# EAGLE design Sapflux-Basic_AltA (EAGLE 9.6.2)
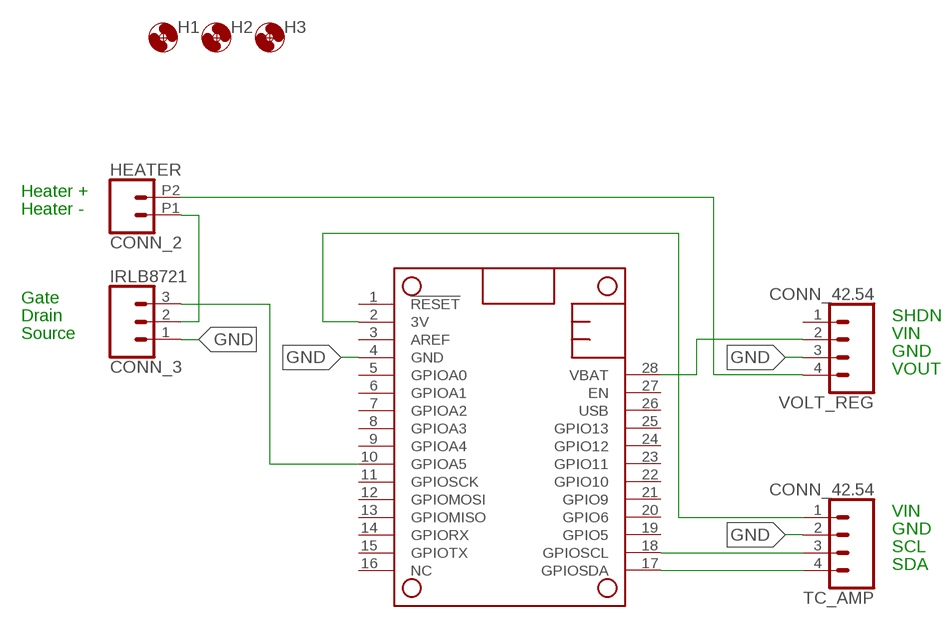
[diagram p0: schematic, sheet 1]

## Parts
H1  MOUNTING_HOLE4_NP  [4_40]
H2  MOUNTING_HOLE4_NP  [4_40]
H3  MOUNTING_HOLE4_NP  [4_40]
HEATER  CONN_2  CONN_022.54_SCREW_ROUND  [1X02_2.54_SCREWTERM_ROUND]
IRLB8721  CONN_3  [1X03]
MS1  FEATHERWINGLAYOUT  [FEATHERWING_MIN]
TC_AMP  CONN_42.54  [1X04]
VOLT_REG  CONN_42.54  [1X04]

## Nets
3V: MS1.2(3V) TC_AMP.1
GND: IRLB8721.1 MS1.4(GND) TC_AMP.2 VOLT_REG.3
N$1: MS1.17(GPIOSDA) TC_AMP.4
N$2: MS1.18(GPIOSCL) TC_AMP.3
N$3: HEATER.P2 VOLT_REG.4
N$4: HEATER.P1 IRLB8721.2
N$5: IRLB8721.3 MS1.10(GPIOA5)
VBAT: MS1.28(VBAT) VOLT_REG.2
Unconnected: MS1.1(!RESET) MS1.3(AREF) MS1.5(GPIOA0) MS1.6(GPIOA1) MS1.7(GPIOA2) MS1.8(GPIOA3) MS1.9(GPIOA4) MS1.11(GPIOSCK) MS1.12(GPIOMOSI) MS1.13(GPIOMISO) MS1.14(GPIORX) MS1.15(GPIOTX) MS1.16(NC) MS1.19(GPIO5) MS1.20(GPIO6) MS1.21(GPIO9) MS1.22(GPIO10) MS1.23(GPIO11) MS1.24(GPIO12) MS1.25(GPIO13) MS1.26(USB) MS1.27(EN) VOLT_REG.1

## Notes on the sheet
- Heater +
- Heater -
- Gate
- Drain | SHDN
- Source | VIN
- GND
- VOUT
- VIN
- GND
- SCL
- SDA

## Library data of the parts
H1-H3 = bschulz:MOUNTING_HOLE: Genaric Mechanical Mounting Hole Hole diameter based on max body diameter + 15% Keepout ring is for diameter of socket cap screw (minimum required clearance) TPlace ring is for diameter of pan head screw (recomended clearance) Specifications: Socket Cap <http://fastener-express.com/fastener-technical/SocketscapSS-Alloy.pdf> Button Head Socket Cap <http://fastener-express.com/fastener-technical/Button-Socket-alloy.pdf> Pan Head <http://fastener-express.com/fastener-technical/pan-machine-Screws.pdf>; DIGIKEY: DNP; MF: N/A; MPN: DNP
HEATER = bschulz:CONN_02: Genaric 2 terminal header SCREW_2.54 <https://www.digikey.com/product-detail/en/on-shore-technology-inc/OSTVN02A150/ED10561-ND/1588862> 39532_RA <https://www.digikey.com/product-detail/en/molex/0395321002/WM7845-ND/1280696>; DIGIKEY: ED10561-ND; MF: OnShore; MPN: OSTVN02A150
IRLB8721 = bschulz:CONN_3: Genaric 3 terminal header Digikey 2.54_SCREW <https://www.digikey.com/product-detail/en/on-shore-technology-inc/OSTVN03A150/ED10562-ND/1588863> 3.5_SCREW <https://www.digikey.com/product-detail/en/on-shore-technology-inc/OSTTE030161/ED2636-ND/614585> 5.08_PLUG <https://www.digikey.com/en/products/detail/phoenix-contact/1755749/260519>
MS1 = bschulz:FEATHERWING
TC_AMP VOLT_REG = bschulz:CONN_4: Genaric 4 terminal header Digikey 2.54_SCREW <https://www.digikey.com/product-detail/en/on-shore-technology-inc/OSTVN04A150/ED10563-ND/1588864>

## Board
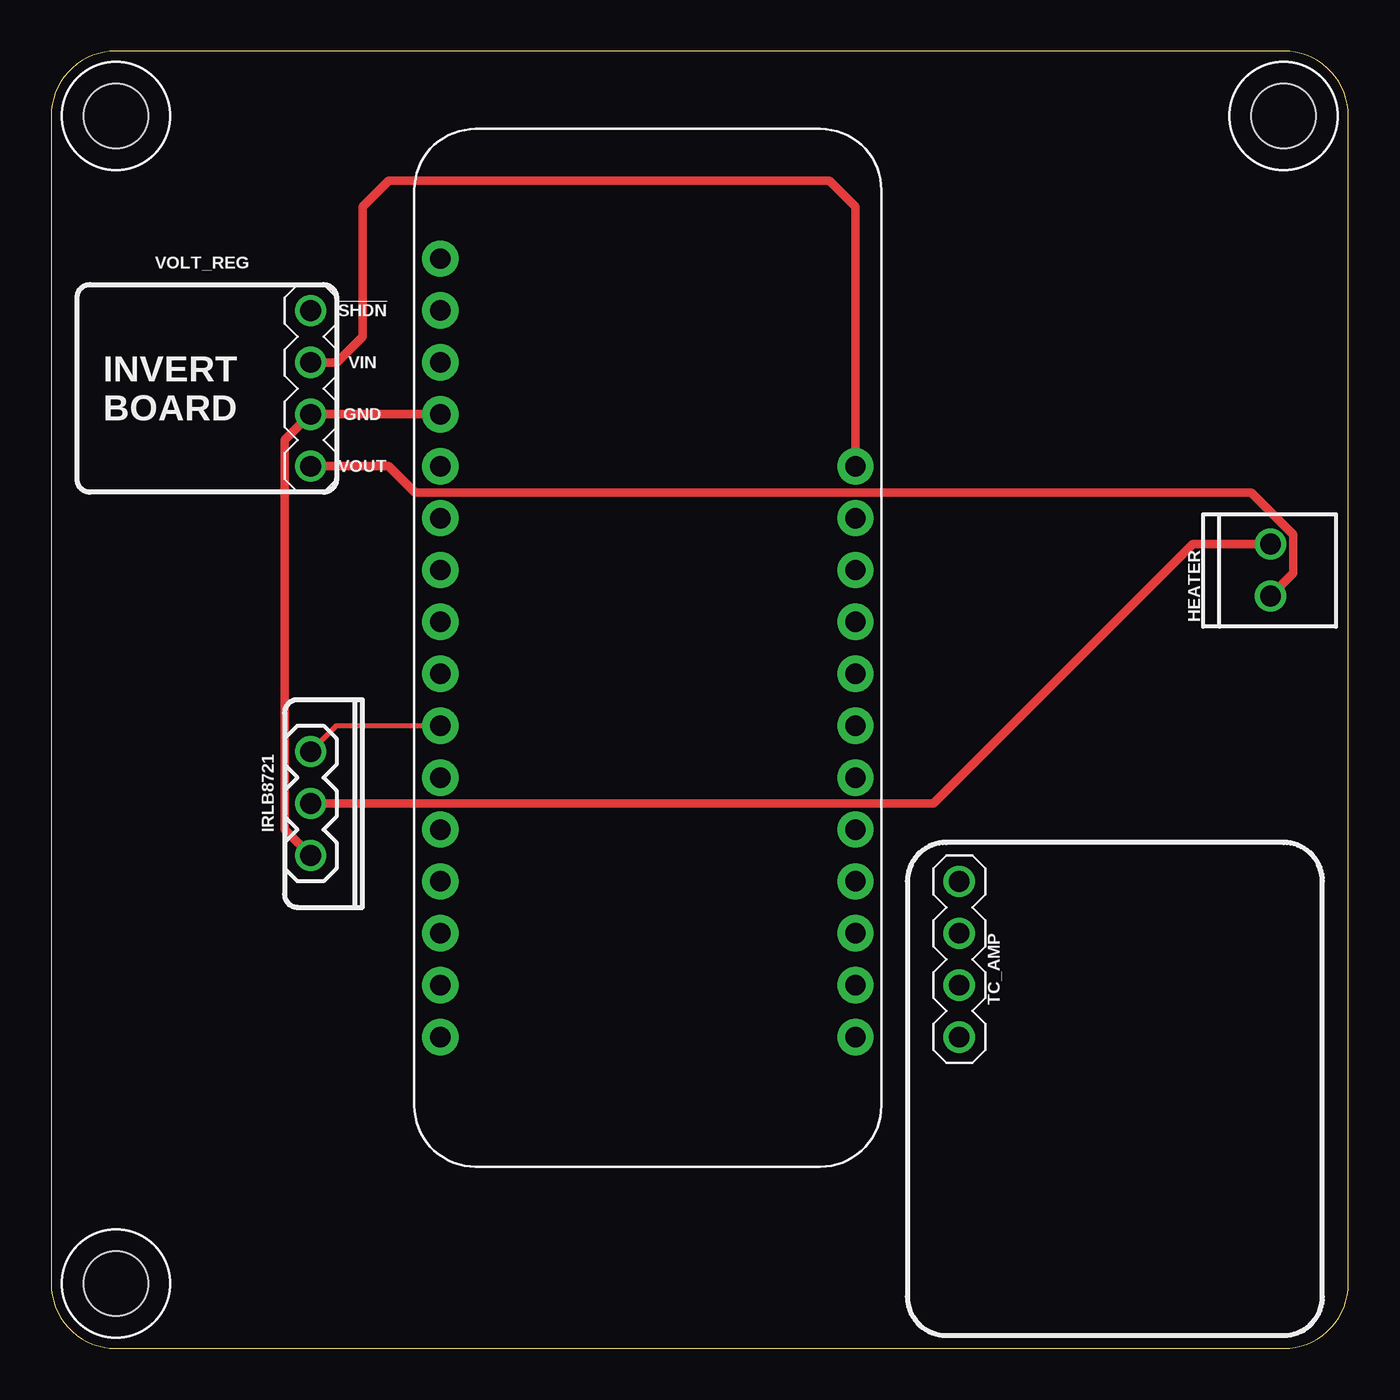
[diagram p1: board, top side]
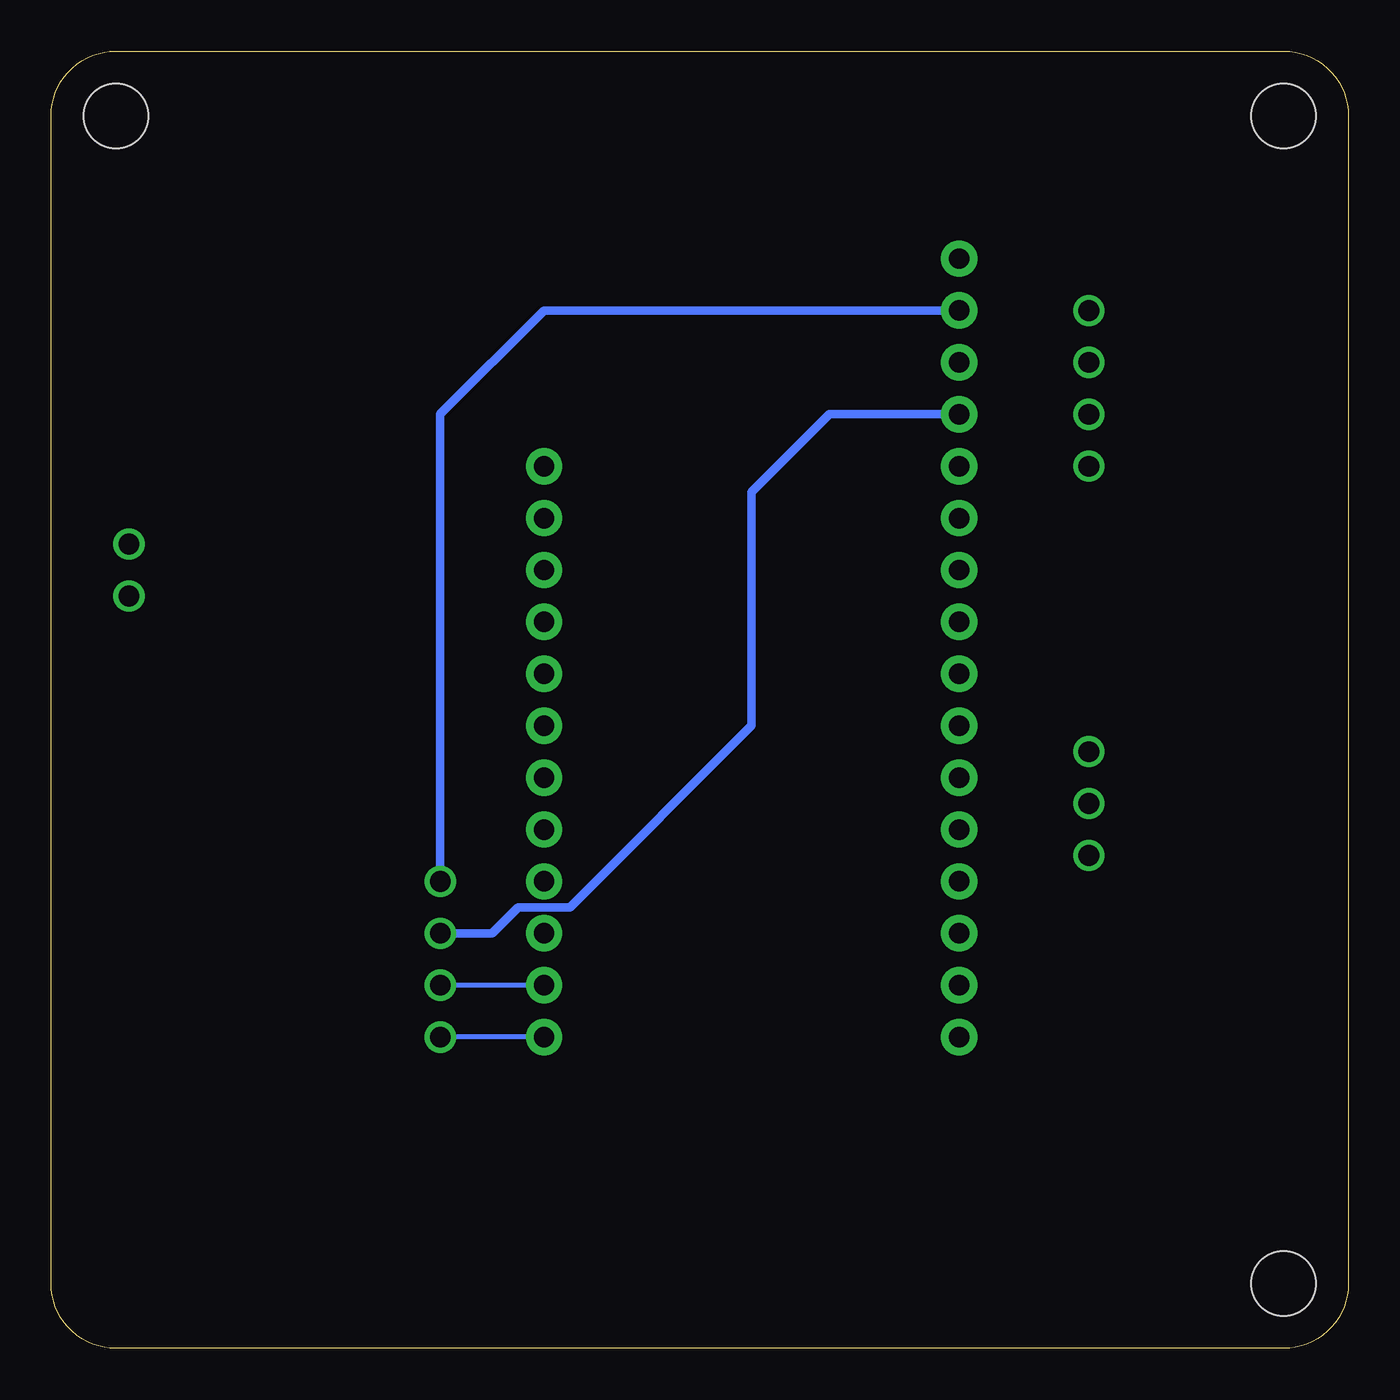
[diagram p2: board, bottom side, seen from below]

Size 63.5 x 63.5 mm. Coordinates in mm from the lower left corner, seen from the top.
Outline: 3.17,0 60.33,0 arc90 63.5,3.17 63.5,60.33 arc90 60.33,63.5 3.17,63.5 arc90 0,60.33 0,3.17 arc90 3.17,0
Copper layers (1*16): Top 0.035559375mm / dielectric 1.6mm / Bottom 0.035559375mm
Design rules "oshpark-2layer": minimum track width 6mil, minimum drill 10mil, track to track 6mil, track to pad 6mil, pad to pad 6mil, via to via 6mil, smd to smd 6mil, copper to edge 15mil, drill to drill 6mil, minimum pad ring 5mil, minimum via ring 5mil, stop-mask expansion 2.5mil, vias tented up to drill 0mil, thermal gap 10mil

### Footprints (pad centres in the part's own frame; a part is rotated, then mirrored left to right if it is on the bottom)
4_40 = hole 3.175: 0,0
1X02_2.54_SCREWTERM_ROUND = drill 1.016: P1 1.27,0; P2 -1.27,0
1X03 = drill 1.016: 1 -2.54,0; 2 0,0; 3 2.54,0
FEATHERWING_MIN = drill 1 pad 1.778: 1 6.35,1.27; 2 8.89,1.27; 3 11.43,1.27; 4 13.97,1.27; 5 16.51,1.27; 6 19.05,1.27; 7 21.59,1.27; 8 24.13,1.27; 9 26.67,1.27; 10 29.21,1.27; 11 31.75,1.27; 12 34.29,1.27; 13 36.83,1.27; 14 39.37,1.27; 15 41.91,1.27; 16 44.45,1.27; 17 44.45,21.59; 18 41.91,21.59; 19 39.37,21.59; 20 36.83,21.59; 21 34.29,21.59; 22 31.75,21.59; 23 29.21,21.59; 24 26.67,21.59; 25 24.13,21.59; 26 21.59,21.59; 27 19.05,21.59; 28 16.51,21.59
1X04 = drill 1.016: 1 -3.81,0; 2 -1.27,0; 3 1.27,0; 4 3.81,0

### Placement (x,y rotation side)
H1  3.17,3.17 0 top
H2  3.17,60.33 0 top
H3  60.33,60.33 0 top
HEATER  59.69,38.1 90 top
IRLB8721  12.7,26.67 90 top
MS1  17.78,59.69 270 top
TC_AMP  44.45,19.05 270 top
VOLT_REG  12.7,46.99 270 top

### Tracks (layer width: path | path; a pad name or v marks a point on that pad's centre or on a via)
3V
  Bottom 0.406: MS1.2 39.37,50.8 44.45,45.72 TC_AMP.1
GND
  Top 0.406: MS1.4 VOLT_REG.3 11.43,44.45 11.43,25.4 IRLB8721.1
  Bottom 0.406: MS1.4 25.4,45.72 29.21,41.91 29.21,30.48 38.1,21.59 40.64,21.59 41.91,20.32 TC_AMP.2
N$1
  Bottom 0.254: MS1.17 TC_AMP.4
N$2
  Bottom 0.254: MS1.18 TC_AMP.3
N$3
  Top 0.406: VOLT_REG.4 16.51,43.18 17.8,41.88 58.76,41.88 60.81,39.83 60.81,37.95 HEATER.P2
N$4
  Top 0.406: HEATER.P1 55.88,39.37 43.18,26.67 IRLB8721.2
N$5
  Top 0.254: IRLB8721.3 13.97,30.48 MS1.10
VBAT
  Top 0.406: VOLT_REG.2 13.97,48.26 15.24,49.53 15.24,55.88 16.51,57.15 38.1,57.15 39.37,55.88 MS1.28

### Text on the board
tPlace: !SHDN | VIN | INVERT / BOARD | GND | VOUT
tDocu: Sapflux-Basic / AltA / v0.0 / Xiating Chen / Bobby Schulz